# Altium schematic sheet Master MicroController Port E.SchDoc: Master Micro Controller Port E Pin Out
size A4; DocumentNumber: 20; SheetNumber: 20; SheetTotal: 54
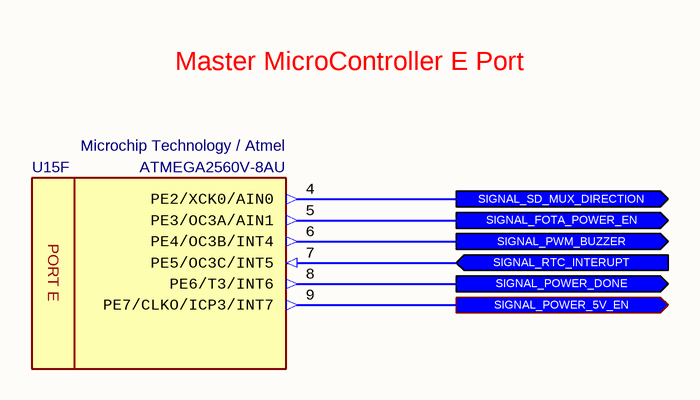
[diagram p0: Master MicroController Port E.SchDoc]

## Parts
U15  Manufacturer_Part_Number: ATMEGA2560V-8AU  Manufacturer_Name: Microchip Technology / Atmel  [TQFP100]  (hidden comment: 8-bit MicroController)  (part F of 15)

## Ports
SIGNAL_FOTA_POWER_EN (out), SIGNAL_POWER_5V_EN (out), SIGNAL_POWER_DONE (out), SIGNAL_PWM_BUZZER (out), SIGNAL_RTC_INTERUPT (in), SIGNAL_SD_MUX_DIRECTION (out)

## Nets
SIGNAL_FOTA_POWER_EN: U15.5(PE3/OC3A/AIN1) ; port SIGNAL_FOTA_POWER_EN
SIGNAL_POWER_5V_EN: U15.9(PE7/CLKO/ICP3/INT7) ; port SIGNAL_POWER_5V_EN
SIGNAL_POWER_DONE: U15.8(PE6/T3/INT6) ; port SIGNAL_POWER_DONE
SIGNAL_PWM_BUZZER: U15.6(PE4/OC3B/INT4) ; port SIGNAL_PWM_BUZZER
SIGNAL_RTC_INTERUPT: U15.7(PE5/OC3C/INT5) ; port SIGNAL_RTC_INTERUPT
SIGNAL_SD_MUX_DIRECTION: U15.4(PE2/XCK0/AIN0) ; port SIGNAL_SD_MUX_DIRECTION

## Notes on the sheet
- Master MicroController E Port
- Engineer
- All Rights are reserved to Customer and Engineer. [2021]
- Size:
- Date:
- A4
- Project :
- Time:
- Sheet
- of
- Customer
- Product ID
- Module ID
- Version
- File:
- Revision
- (in symbol IC - ATMEGA2560V-8AU, part F) PORT E

## Library data of the parts
U15 = IC - ATMEGA2560V-8AU: 8-bit Microcontrollers - MCU 256kB Flash 4kB EEPROM 86 I/O Pins; Supply Voltage - Min: 2V7; Supply Voltage - Max: 5.5V; Height: 1mm; Mouser_Part_Number: 556-ATMEGA2560V8AU; ComponentLink1Description: DataSheet; ComponentLink1URL: https://eu.mouser.com/datasheet/2/268/Atmel-2549-8-bit-AVR-Microcontroller-ATmega640-128-1315286.pdf; ROHS: Yes; Minimum Operating Temperature: -40; Maximum Operating Temperature: +85; ComponentLink2Description: Mouser; ComponentLink2URL: https://eu.mouser.com/ProductDetail/Microchip-Technology-Atmel/ATMEGA2560V-8AU?qs=sGAEpiMZZMutXGli8Ay4kKlCYcvZUWqJYdtgGFyqFT8%3D; Supplier 1: Mouser; Supplier 2: Arrow; Supplier 3: Farnell; Supplier 4: Newark; Supplier 5: Digi-Key; Supplier Part Number 1: 556-ATMEGA2560V8AU; Supplier Part Number 2: ATMEGA2560V-8AU; Supplier Part Number 3: 1288331; Supplier Part Number 4: 68T2784; Supplier Part Number 5: ATMEGA2560V-8AU-ND; Case: TQFP-100